# Altium schematic sheet [XX] - BLANK SCHEMATIC.SchDoc
size A3; DocumentNumber: 3; SheetNumber: 3; SheetTotal: 5
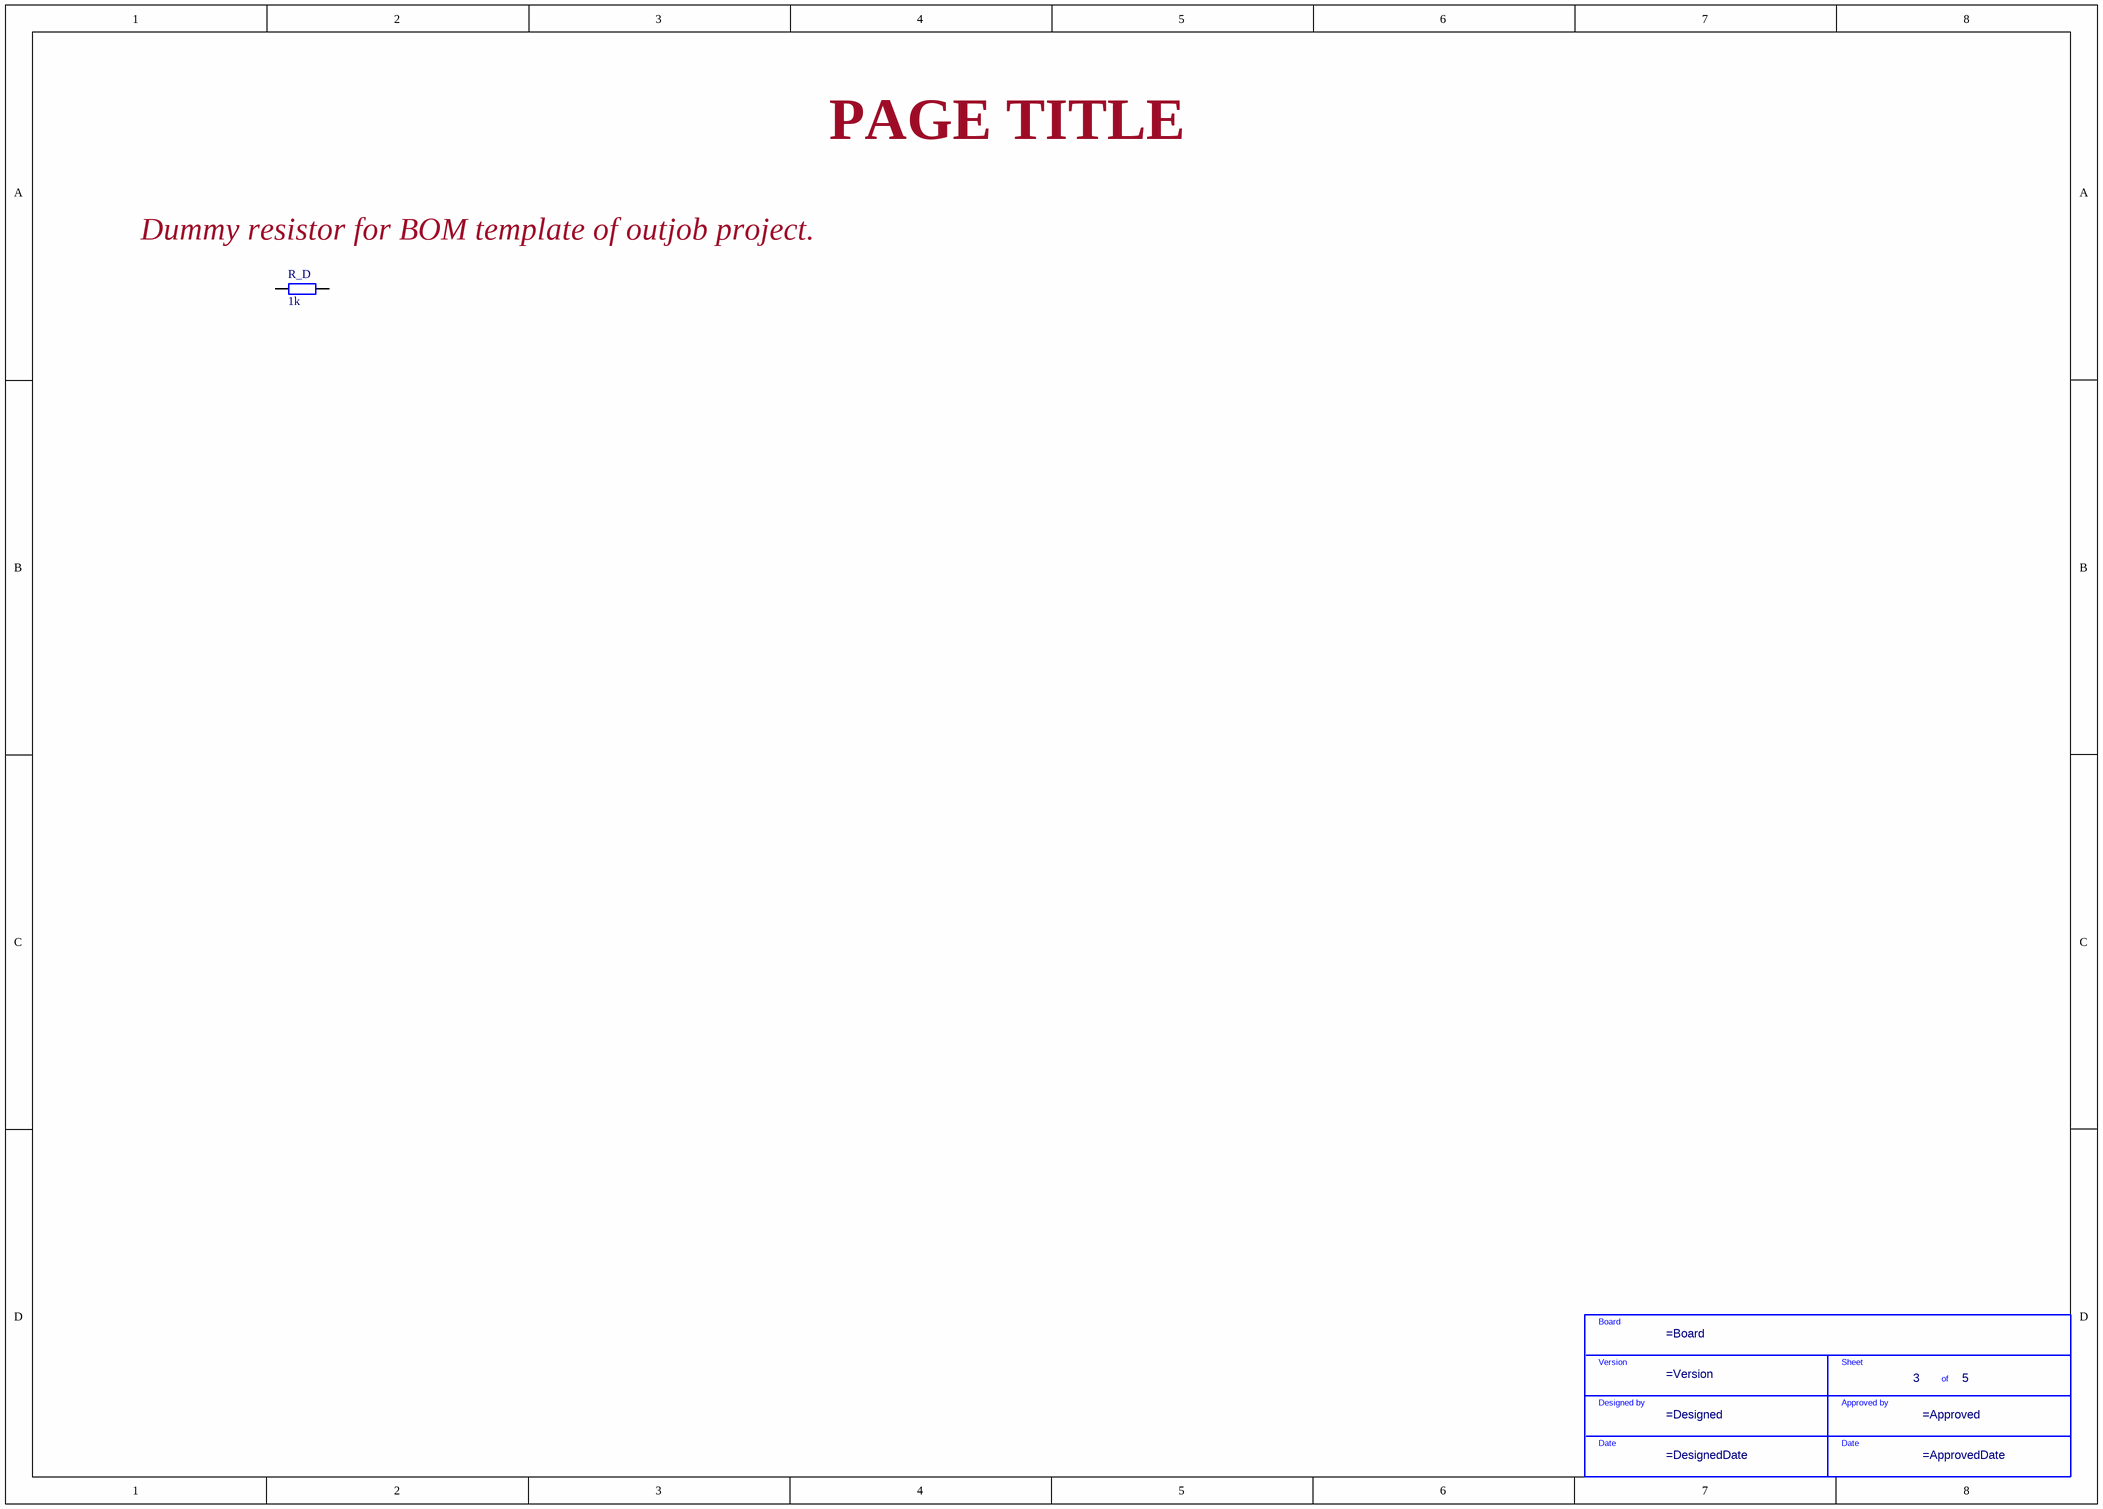
[diagram p0: [XX] - BLANK SCHEMATIC.SchDoc]

## Parts
R_D  1k  [R0805]
STB  -  (value not drawn)  (graphical)

## Nets

Not connected (* = marked no-connect by the designer): R_D 1 2

## Notes on the sheet
- PAGE TITLE
- (near R_D) Dummy resistor for BOM template of outjob project.
- CLOCKS (CPU & PCIE)
- (in symbol Schematic Title Block) Board; Version; Sheet; of; Designed by; Approved by; Date

## Library data of the parts
R_D = CRCW08051K00FKEA: RES 1K 0805 0.125W; Manufacturer: Vishay Dale; Tolerance: ±1%; Power (Watts): 0.125W, 1/8W; Temperature Coefficient: ±100ppm/°C; .PCBChecked: BP; Supplier 1: Avnet Abacus; Manufacturer Part Number: CRCW08051K00FKEA; RoHS: RoHS Compliant; Category: Resistors; Stock 1: 528553; Pricing 1: 1=0.1, 10=0.042, 25=0.0304, 50=0.0232, 100=0.017, 250=0.013, 500=0.0104, 1000=0.00765 (USD); Packaging: Cut Tape (CT); Part Status: Active; Resistance (Ohms): 1k; Composition: Thick Film; Features: Automotive AEC-Q200; Operating Temperature: -55°C ~ 155°C; Package: 0805 (2012 Metric); Supplier Device Package: 0805; Size / Dimension: 0.079" L x 0.049" W (2.00mm x 1.25mm); Height - Seated (Max): 0.020" (0.50mm); Failure Rate: -; ComponentLink1URL: http://www.vishay.com/docs/20035/dcrcwe3.pdf; ComponentLink1Description: Datasheet; Supplier Part Number 1: CRCW08051K00FKEA; Type: SMD; .SCHChecked: BP
STB = Schematic Title Block